# Altium schematic sheet Driver_Ampli.SchDoc
size A4
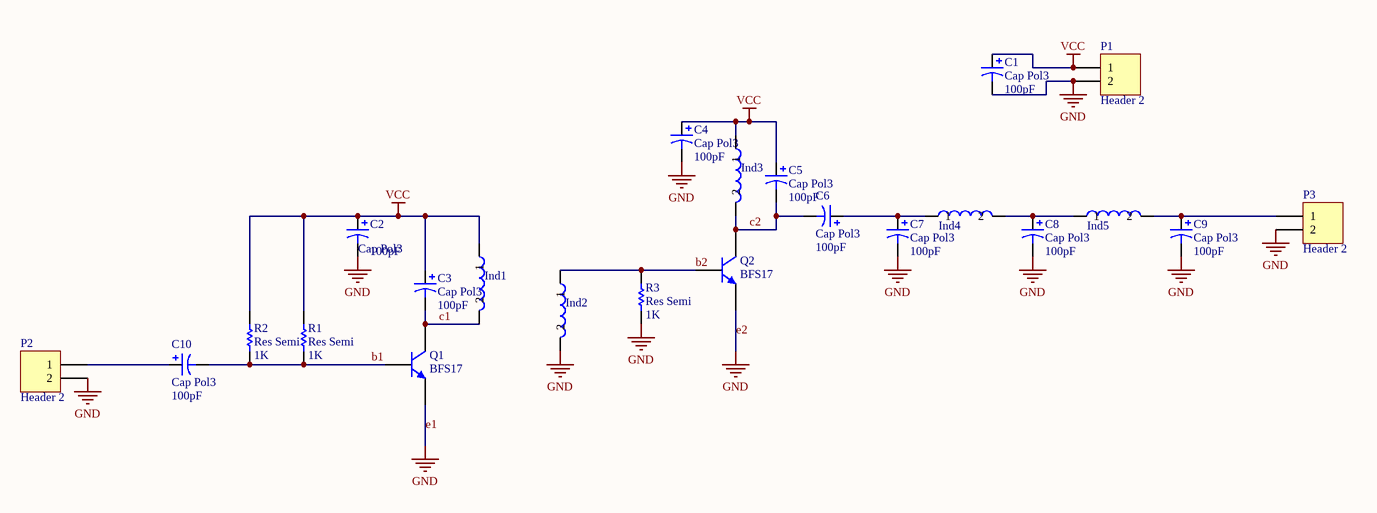
[diagram p0: Driver_Ampli.SchDoc]

## Parts
C1  Cap Pol3  value 100pF  [C0805]
C2  Cap Pol3  value 100pF  [C0805]
C3  Cap Pol3  value 100pF  [C0805]
C4  Cap Pol3  value 100pF  [C0805]
C5  Cap Pol3  value 100pF  [C0805]
C6  Cap Pol3  value 100pF  [C0805]
C7  Cap Pol3  value 100pF  [C0805]
C8  Cap Pol3  value 100pF  [C0805]
C9  Cap Pol3  value 100pF  [C0805]
C10  Cap Pol3  value 100pF  [C0805]
Ind1  Ind2  [Ind_3mm]  (value not drawn)
Ind2  Ind2  [Ind_3mm]  (value not drawn)
Ind3  Ind2  [Ind_3mm]  (value not drawn)
Ind4  Ind2  [Ind_3mm]  (value not drawn)
Ind5  Ind2  [Ind_3mm]  (value not drawn)
P1  Header 2  [HDR1X2]
P2  Header 2  [HDR1X2]
P3  Header 2  [HDR1X2]
Q1  BFS17  [SOT23]
Q2  BFS17  [SOT23]
R1  Res Semi  value 1K  [2012[0805]]
R2  Res Semi  value 1K  [2012[0805]]
R3  Res Semi  value 1K  [2012[0805]]

## Nets
e1: C1.2 C2.2 C4.2 C7.2 C8.2 C9.2 Ind2.2 P1.2 P2.2 P3.2 Q1.2(E) Q2.2(E) R3.1  [also labelled e2, GND]
VCC: C1.1 C2.1 C3.1 C4.1 C5.1 Ind1.1 Ind3.1 P1.1 R1.2 R2.2
b1: C10.2 Q1.1(B) R1.1 R2.1
b2: Ind2.1 Q2.1(B) R3.2
c1: C3.2 Ind1.2 Q1.3(C)
c2: C5.2 C6.2 Ind3.2 Q2.3(C)
NetC6_1: C6.1 C7.1 Ind4.1
NetC8_1: C8.1 Ind4.2 Ind5.1
NetC9_1: C9.1 Ind5.2 P3.1
NetC10_1: C10.1 P2.1

## Library data of the parts
C1-C10 = Cap Pol3: Polarized Capacitor (Surface Mount); Published: 8-Jun-2000; LatestRevisionDate: 17-Jul-2002; LatestRevisionNote: Re-released for DXP Platform.; PackageReference: C0805; Publisher: Altium Limited
P1-P3 = Header 2: Header, 2-Pin; LatestRevisionDate: 17-Jul-2002; LatestRevisionNote: Re-released for DXP Platform.; Publisher: Altium Limited
Q1 Q2 = BFS17: NPN 1 GHz Wideband Transistor; Published: 17-Sep-2003; DatasheetDocument: Sep-1995; PackageDocument: May-1999; PackageReference: SOT23; Publisher: Altium Limited; ComponentLink1Description: Manufacturer Link; ComponentLink1URL: http://www.semiconductors.philips.com/; ComponentLink2Description: Datasheet; ComponentLink2URL: http://www.semiconductors.philips.com/acrobat/datasheets/BFS17_2.pdf
R1-R3 = Res Semi: Semiconductor Resistor; Published: 8-Jun-2000; LatestRevisionDate: 17-Jul-2002; LatestRevisionNote: Re-released for DXP Platform.; PackageReference: AXIAL-0.5; Publisher: Altium Limited